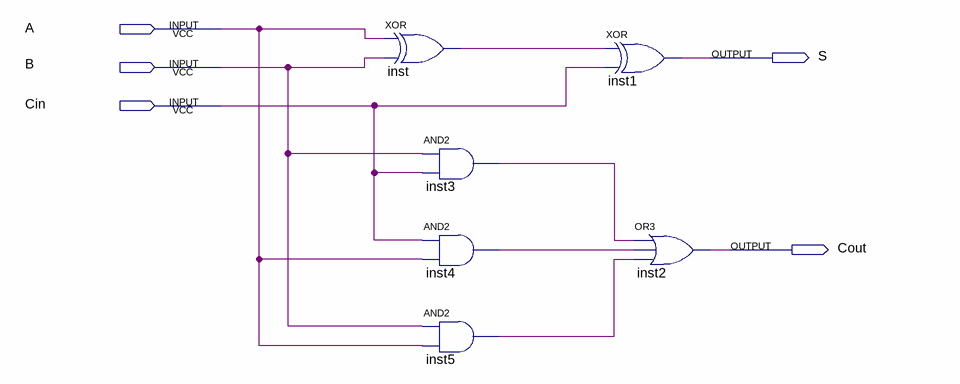
[diagram p0: schematic sheet]
// Quartus schematic somador.bdf as structural Verilog: 6 symbols, 5 pins
module somador (
  input  A,
  input  B,
  input  Cin,
  output S,
  output Cout
);

  wire inst3_out, inst4_out, inst5_out, inst_out;

  xor inst (inst_out, A, B);
  and inst3 (inst3_out, B, Cin);
  and inst4 (inst4_out, Cin, A);
  and inst5 (inst5_out, B, A);
  xor inst1 (S, inst_out, Cin);
  or inst2 (Cout, inst3_out, inst4_out, inst5_out);
endmodule
